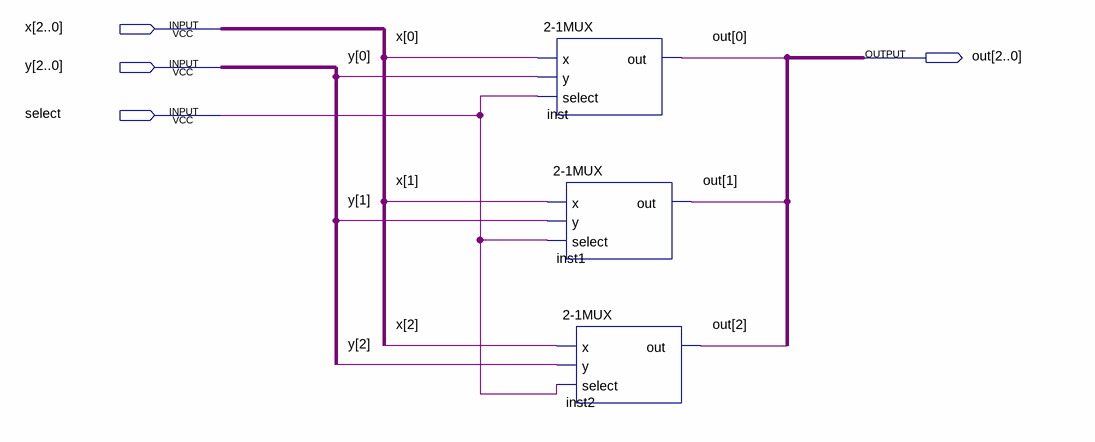
[diagram p0: schematic sheet]
// Quartus schematic 2-1mux_3b.bdf as structural Verilog: 3 symbols, 4 pins
module \2-1mux_3b  (
  input  [2:0] x,
  input  [2:0] y,
  input  select,
  output [2:0] out
);

  \2-1MUX  inst (.x(x[0]), .y(y[0]), .select(select), .out(out[0]));
  \2-1MUX  inst1 (.x(x[1]), .y(y[1]), .select(select), .out(out[1]));
  \2-1MUX  inst2 (.x(x[2]), .y(y[2]), .select(select), .out(out[2]));
endmodule
